# EAGLE schematic TestboardForstuff (EAGLE 9.2.1)
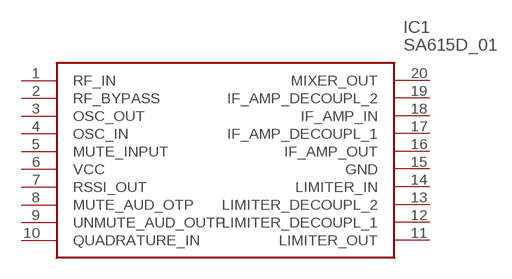
[diagram p0: schematic, sheet 1]

## Parts
IC1  SA615D_01  [SOIC127P1032X265-20N]
Unconnected: IC1.1(RF_IN) IC1.2(RF_BYPASS) IC1.3(OSC_OUT) IC1.4(OSC_IN) IC1.5(MUTE_INPUT) IC1.6(VCC) IC1.7(RSSI_OUT) IC1.8(MUTE_AUD_OTP) IC1.9(UNMUTE_AUD_OUTP) IC1.10(QUADRATURE_IN) IC1.11(LIMITER_OUT) IC1.12(LIMITER_DECOUPL_1) IC1.13(LIMITER_DECOUPL_2) IC1.14(LIMITER_IN) IC1.15(GND) IC1.16(IF_AMP_OUT) IC1.17(IF_AMP_DECOUPL_1) IC1.18(IF_AMP_IN) IC1.19(IF_AMP_DECOUPL_2) IC1.20(MIXER_OUT)

## Library data of the parts
IC1 = SamacSys_Parts:SA615D_01: Up-Down Converters HI PERF LP MIXER FM IF SYSTEM Source: Datasheet <https://componentsearchengine.com/Datasheets/1/SA615D_01.pdf>; DESCRIPTION: Up-Down Converters HI PERF LP MIXER FM IF SYSTEM; HEIGHT: 2.65mm; MANUFACTURER_NAME: Nexperia; MANUFACTURER_PART_NUMBER: SA615D/01; MOUSER_PART_NUMBER: 771-SA615D/01; MOUSER_PRICE-STOCK: https://www.mouser.com/Search/Refine.aspx?Keyword=771-SA615D%2F01